# EAGLE schematic Esp32-H2-wroom-u1-Nx (EAGLE 9.6.2)
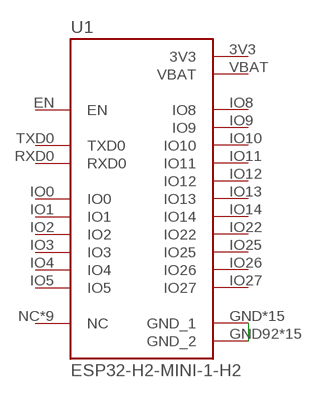
[diagram p0: schematic, sheet 1]

## Parts
U1  ESP32-H2-MINI-1-H2  [MODULE_ESP32-H2-MINI-1-H2]

## Nets
N$1: U1.GND92(GND_2) U1.GND96(GND_2) U1.GND113(GND_1) U1.GND(GND_1) U1.GND@1(GND_1) U1.GND@2(GND_1) U1.GND@3(GND_1) U1.GND@4(GND_1) U1.GND@5(GND_1) U1.GND@6(GND_1) U1.GND@7(GND_1) U1.GND@8(GND_1) U1.GND@9(GND_1) U1.GND@10(GND_1) U1.GND@11(GND_1) U1.GND@12(GND_1) U1.GND@14(GND_1) U1.GND@15(GND_2) U1.GND@16(GND_2) U1.GND@50(GND_2) U1.GND@51(GND_2) U1.GND@52(GND_2) U1.GND@53(GND_2) U1.GND@93(GND_2) U1.GND@94(GND_2) U1.GND@95(GND_2) U1.GND@97(GND_2) U1.GND@98(GND_2) U1.GND@99(GND_2) U1.GND@100(GND_2)
Unconnected: U1.EN U1.IO0 U1.IO1 U1.IO2 U1.IO3 U1.IO4 U1.IO5 U1.IO8 U1.IO9 U1.IO10 U1.IO11 U1.IO12 U1.IO13 U1.IO14 U1.IO22 U1.IO25 U1.IO26 U1.IO27 U1.NC U1.NC@1(NC) U1.NC@2(NC) U1.NC@4(NC) U1.NC@5(NC) U1.NC@6(NC) U1.NC@7(NC) U1.NC@8(NC) U1.NC@9(NC) U1.RXD0 U1.TXD0

## Power pins joined to a net without a drawn wire
3V3: U1.3V3
VBAT: U1.VBAT

## Library data of the parts
U1 = ESP32-H2-MINI-1-H2-Pinbelegung-richtig:ESP32-H2-MINI-1-H2: Check availability <https://pricing.snapeda.com/parts/ESP32-H2-MINI-1-H2/Espressif%20Systems/view-part?ref=eda>; AVAILABILITY: In Stock; CHECK_PRICES: https://www.snapeda.com/parts/ESP32-H2-MINI-1-H2/Espressif+Systems/view-part/?ref=eda; DESCRIPTION: 802.15.4, Bluetooth Bluetooth v5.3, Zigbee® Transceiver Module 2.4GHz Integrated, Trace Surface Mount; MF: Espressif Systems; MP: ESP32-H2-MINI-1-H2; PACKAGE: SMD-53 Espressif Systems; PRICE: None; SNAPEDA_LINK: https://www.snapeda.com/parts/ESP32-H2-MINI-1-H2/Espressif+Systems/view-part/?ref=snap